# EAGLE design LocoShield-TMH-ThroughHole (EAGLE 7.7.0)
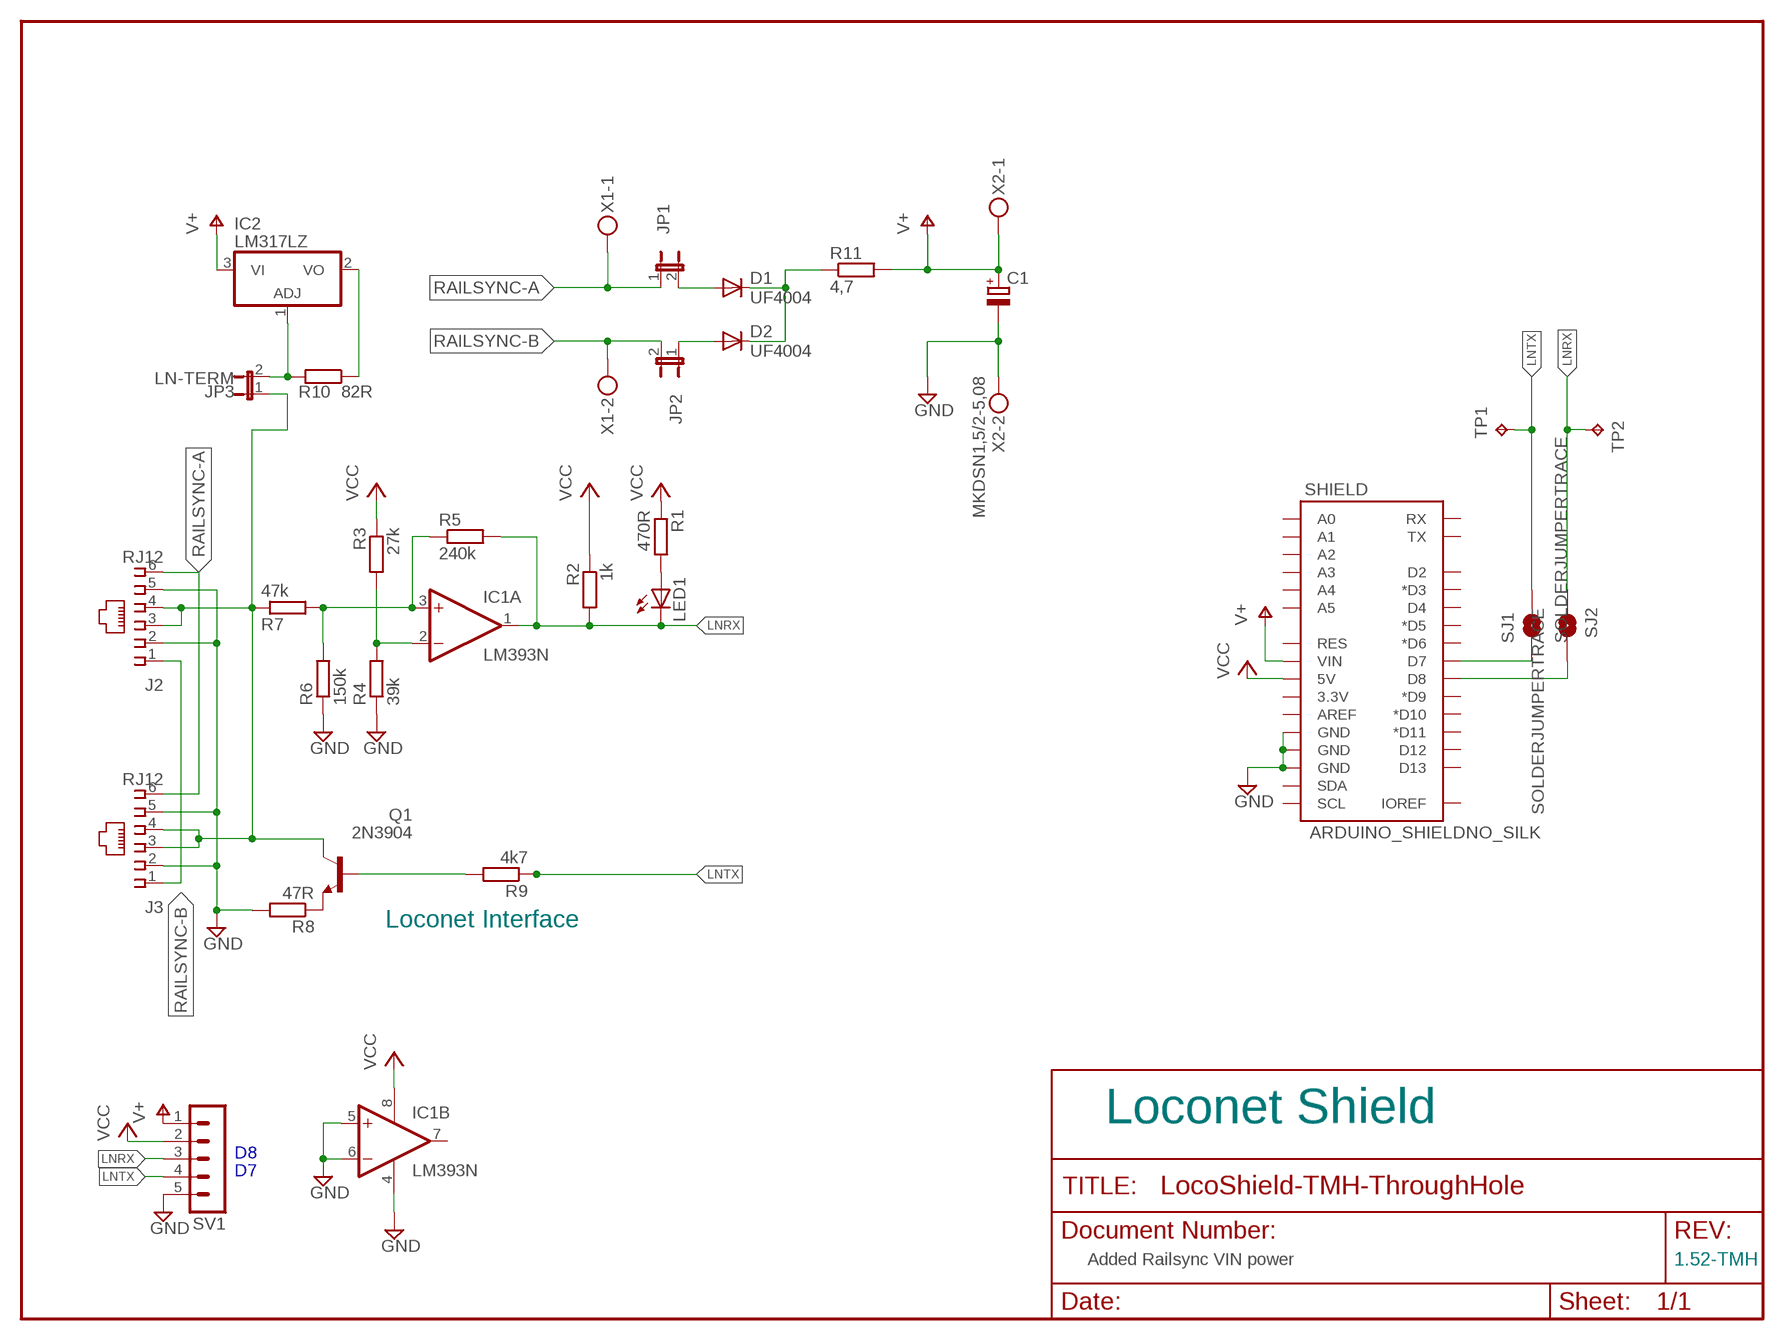
[diagram p0: schematic, sheet 1]

## Parts
C1  CPOL-EUE2-5  [E2-5]
D1  UF4004  1N4148DO35-7  [DO35-7]
D2  UF4004  1N4148DO35-7  [DO35-7]
IC1  LM393N  [DIL08]
IC2  LM317LZ  [TO92]
J2  RJ12  520250-3  [520250-3]
J3  RJ12  520250-3  [520250-3]
JP1  JUMPER-2PTH_LOCK  [1X02_LOCK]
JP2  JUMPER-2PTH_LOCK  [1X02_LOCK]
JP3  LN-TERM  JUMPER-2PTH_LOCK  [1X02_LOCK]
LED1  LED3MM  [LED3MM]
Q1  2N3904  [TO92]
R1  470R  R-EU_0207/10  [0207/10]
R2  1k  R-EU_0207/10  [0207/10]
R3  27k  R-EU_0207/10  [0207/10]
R4  39k  R-EU_0207/10  [0207/10]
R5  240k  R-EU_0207/10  [0207/10]
R6  150k  R-EU_0207/10  [0207/10]
R7  47k  R-EU_0207/10  [0207/10]
R8  47R  R-EU_0207/10  [0207/10]
R9  4k7  R-EU_0207/10  [0207/10]
R10  82R  R-EU_0207/10  [0207/10]
R11  4,7  R-EU_0207/10  [0207/10]
SHIELD  ARDUINO_SHIELDNO_SILK  [DUEMILANOVE_VIAS]
SJ1  SOLDERJUMPERTRACE  [SJ_2S-TRACE]
SJ2  SOLDERJUMPERTRACE  [SJ_2S-TRACE]
SV1  MA05-1  [MA05-1]
TP1  TPPAD1-17  [P1-17]
TP2  TPPAD1-17  [P1-17]
X1  MKDSN1,5/2-5,08  [MKDSN1,5/2-5,08]
X2  MKDSN1,5/2-5,08  [MKDSN1,5/2-5,08]

## Nets
GND [Power]: C1.- IC1.4(P:V-) IC1.5(B:+IN) IC1.6(B:-IN) J2.2 J2.5 J3.2 J3.5 R4.1 R6.1 R8.2 SHIELD.GND@0(GND) SHIELD.GND@1(GND) SHIELD.GND@2(GND) SV1.5 X2.2
LNRX: IC1.1(A:OUT) LED1.K(C) R2.2 R5.2 SJ2.1 SV1.3 TP2.TP
LNTX: R9.1 SJ1.2 SV1.4 TP1.TP
LOCONET [Power]: J2.3 J2.4 J3.3 J3.4 JP3.1 Q1.1(C) R7.1
N$1: Q1.2(B) R9.2
N$2: IC1.3(A:+IN) R5.1 R6.2 R7.2
N$3: D1.A JP1.2
N$4: D2.A JP2.1
N$5: IC1.2(A:-IN) R3.2 R4.2
N$6: Q1.3(E) R8.1
N$7: SHIELD.D8 SJ2.2
N$8: SHIELD.D7 SJ1.1
N$9 [Power]: D1.C D2.C R11.1
N$15: LED1.A R1.2
N$20 [Power]: IC2.1(ADJ) JP3.2 R10.2
RAILSYNC-A: J2.6 J3.6 JP1.1 X1.1
RAILSYNC-B: J2.1 J3.1 JP2.2 X1.2
V+ [Power]: C1.+ IC2.3(VI) R11.2 SHIELD.VIN SV1.1 X2.1
VCC [Power]: IC1.8(P:V+) R1.1 R2.1 R3.1 SHIELD.5V SV1.2
VOUT [Power]: IC2.2(VO) R10.1
Unconnected: IC1.7(B:OUT) SHIELD.3.3V SHIELD.A0 SHIELD.A1 SHIELD.A2 SHIELD.A3 SHIELD.A4 SHIELD.A5 SHIELD.AREF SHIELD.D2 SHIELD.D3(*D3) SHIELD.D4 SHIELD.D5(*D5) SHIELD.D6(*D6) SHIELD.D9(*D9) SHIELD.D10(*D10) SHIELD.D11(*D11) SHIELD.D12 SHIELD.D13 SHIELD.IOREF SHIELD.RES SHIELD.RX SHIELD.SCL SHIELD.SDA SHIELD.TX

## Notes on the sheet
- Loconet Interface
- Loconet Shield
- D8
- D7
- Added Railsync VIN power | 1.52-TMH

## Library data of the parts
C1 = rcl:CPOL-EU: POLARIZED CAPACITOR, European symbol
D1 D2 = diode:1N4148: DIODE high speed (Philips); ELFA: 170-02-221
IC1 = linear:LM393: COMPARATOR; ELFA: 300-19-446
IC2 = linear:*317: Positive VOLTAGE REGULATOR; ELFA: 173-12-085
J2 J3 = con-amp:520250-3: AMP connector; ELFA: 42-688-27
JP1 JP2 = SPCoast:JUMPER-2: Jumper Basic 0.1" spaced jumper. Use with breakaway headers.; ELFA: 124-50-887
JP3 = MCP:JUMPER-2: Jumper Basic 0.1" spaced jumper. Use with breakaway headers.; ELFA: 124-50-887
LED1 = adafruit:LED: LED OSRAM: - CHIPLED LG R971, LG N971, LY N971, LG Q971, LY Q971, LO R971, LY R971 LH N974, LH R974 LS Q976, LO Q976, LY Q976 LO Q996 - Hyper CHIPLED LW Q18S LB Q993, LB Q99A, LB R99A - SideLED LS A670, LO A670, LY A670, LG A670, LP A670 LB A673, LV A673, LT A673, LW A673 LH A674 LY A675 LS A676, LA A676, LO A676, LY A676, LW A676 LS A679, LY A679, LG A679 - Hyper Micro SIDELED® LS Y876, LA Y876, LO Y876, LY Y876 LT Y87S - SmartLED LW L88C, LW L88S LB L89C, LB L89S, LG L890 LS L89K, LO L89K, LY L89K LS L896, LA L896, LO L896, LY L896 - TOPLED LS T670, LO T670, LY T670, LG T670, LP T670 LSG T670, LSP T670, LSY T670, LOP T670, LYG T670 LG T671, LOG T671, LSG T671 LB T673, LV T673, LT T673, LW T673 LH T674 LS T676, LA T676, LO T676, LY T676, LB T676, LH T676, LSB T676, LW T676 LB T67C, LV T67C, LT T67C, LS T67K, LO T67K, LY T67K, LW E67C LS E67B, LA E67B, LO E67B, LY E67B, LB E67C, LV E67C, LT E67C LW T67C LS T679, LY T679, LG T679 LS T770, LO T770, LY T770, LG T770, LP T770 LB T773, LV T773, LT T773, LW T773 LH T774 LS E675, LA E675, LY E675, LS T675 LS T776, LA T776, LO T776, LY T776, LB T776 LHGB T686 LT T68C, LB T68C - Hyper Mini TOPLED® LB M676 - Mini TOPLED Santana® LG M470 LS M47K, LO M47K, LY M47K Source: http://www.osram.convergy.de/; ELFA: 175-01-530
Q1 = transistor:2N3904: NPN TRANSISTOR; ELFA: 171-30-038
R1 = rcl:R-EU_: RESISTOR, European symbol; ELFA: 160-59-206
R2 = rcl:R-EU_: RESISTOR, European symbol; ELFA: 160-59-214
R3 = rcl:R-EU_: RESISTOR, European symbol; ELFA: 160-59-253
R4 = rcl:R-EU_: RESISTOR, European symbol; ELFA: 160-59-257
R5 = rcl:R-EU_: RESISTOR, European symbol; ELFA: 160-59-277
R6 = rcl:R-EU_: RESISTOR, European symbol; ELFA: 160-59-271
R7 = rcl:R-EU_: RESISTOR, European symbol; ELFA: 160-59-259
R8 = rcl:R-EU_: RESISTOR, European symbol; ELFA: 160-59-181
R9 = rcl:R-EU_: RESISTOR, European symbol; ELFA: 160-73-043
R10 = rcl:R-EU_: RESISTOR, European symbol; ELFA: 160-59-187
R11 = rcl:R-EU_: RESISTOR, European symbol; ELFA: 160-59-157
SHIELD = SPCoast:ARDUINO_SHIELD
SJ1 SJ2 = SparkFun-Retired:SOLDERJUMPER: Solder Jumper Standard SMD solder jumper. Used to automate production. Two varients : Normally Open and Normally Closed are the same, but have different paste layers. NC will have a large amount of paste and should jumper during reflow.
SV1 = con-lstb:MA05-1: PIN HEADER; ELFA: 143-00-499; OC_FARNELL: unknown; OC_NEWARK: unknown
TP1 TP2 = testpad:TP: Test pad
X1 X2 = con-phoenix-508:MKDSN1,5/2-5,08: MKDSN 1,5/ 2-5,08 Printklemme Nennstrom: 13,5 A Nennspannung: 250 V Rastermaß: 5,08 mm Polzahl: 2 Anschlussart: Schraubanschluss Montage: Löten Anschlussrichtung Leiter/Platine: 0 ° Artikelnummer: 1729128 Source: http://eshop.phoenixcontact.com .. 1729128.pdf; ELFA: 148-45-038

## Net classes
0 default: width 0.254 mm
1 Power: width 0.406 mm, clearance 0.254 mm

## Board
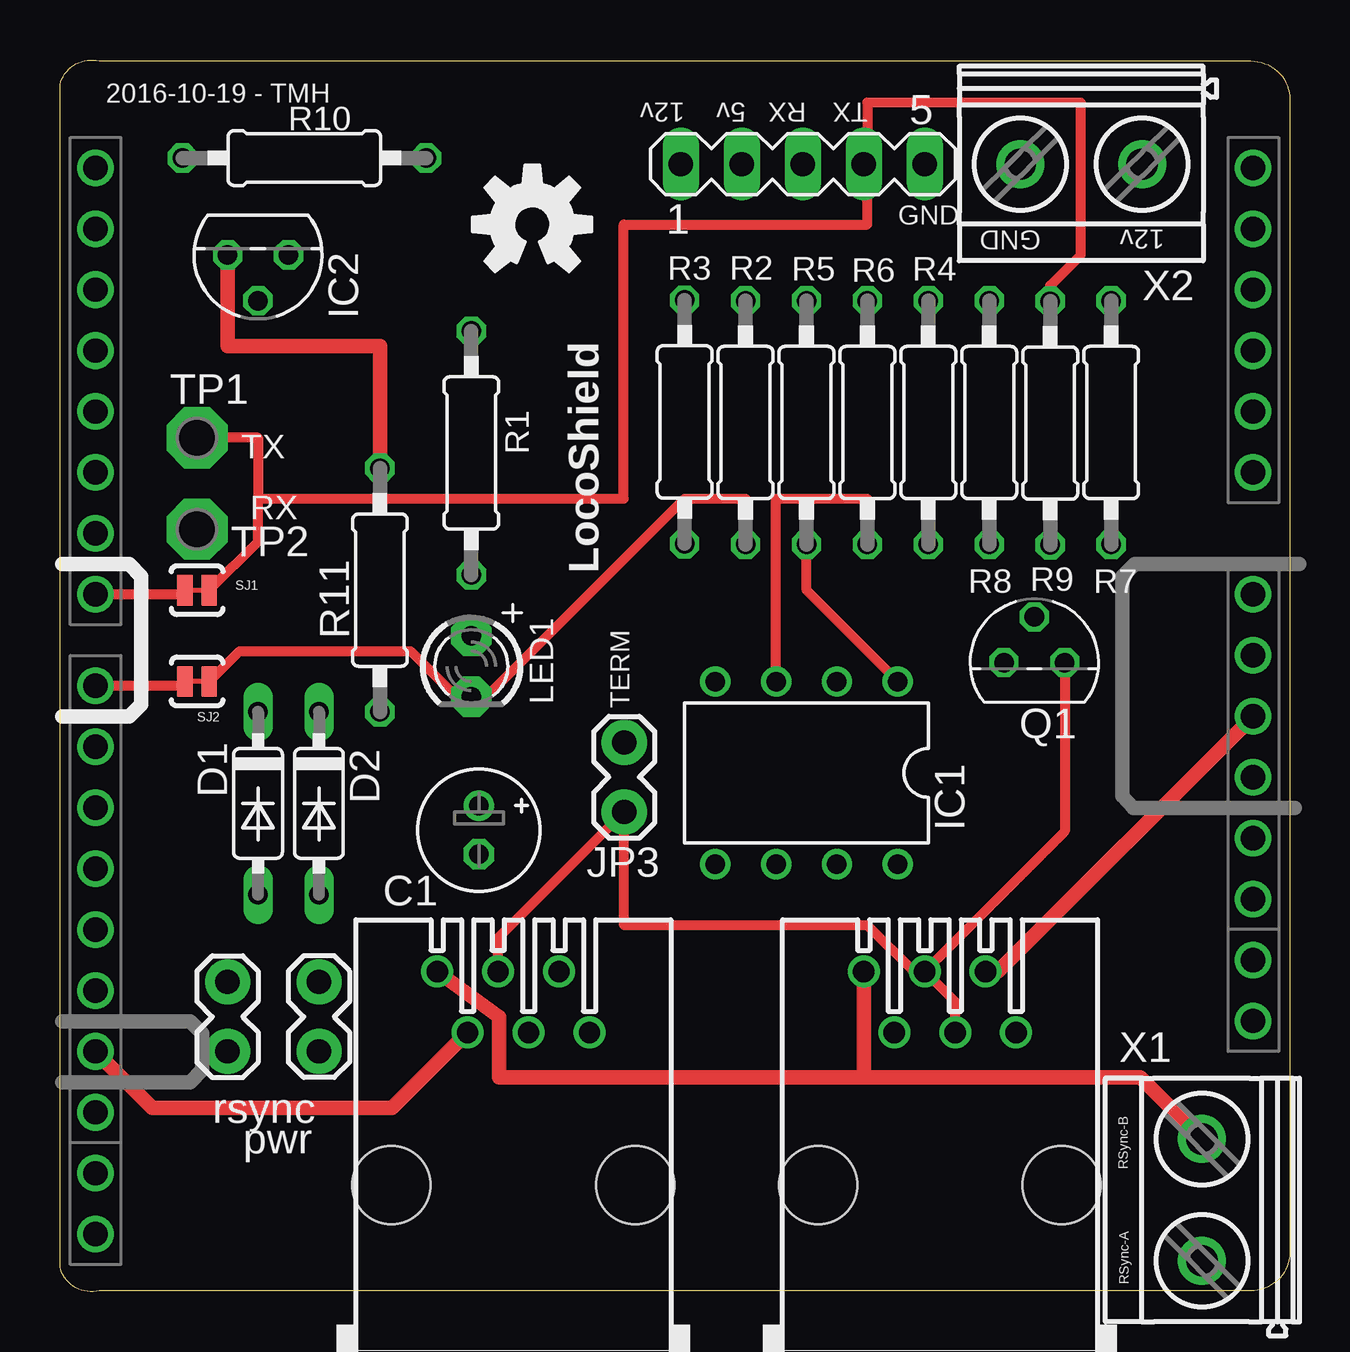
[diagram p1: board, top side]
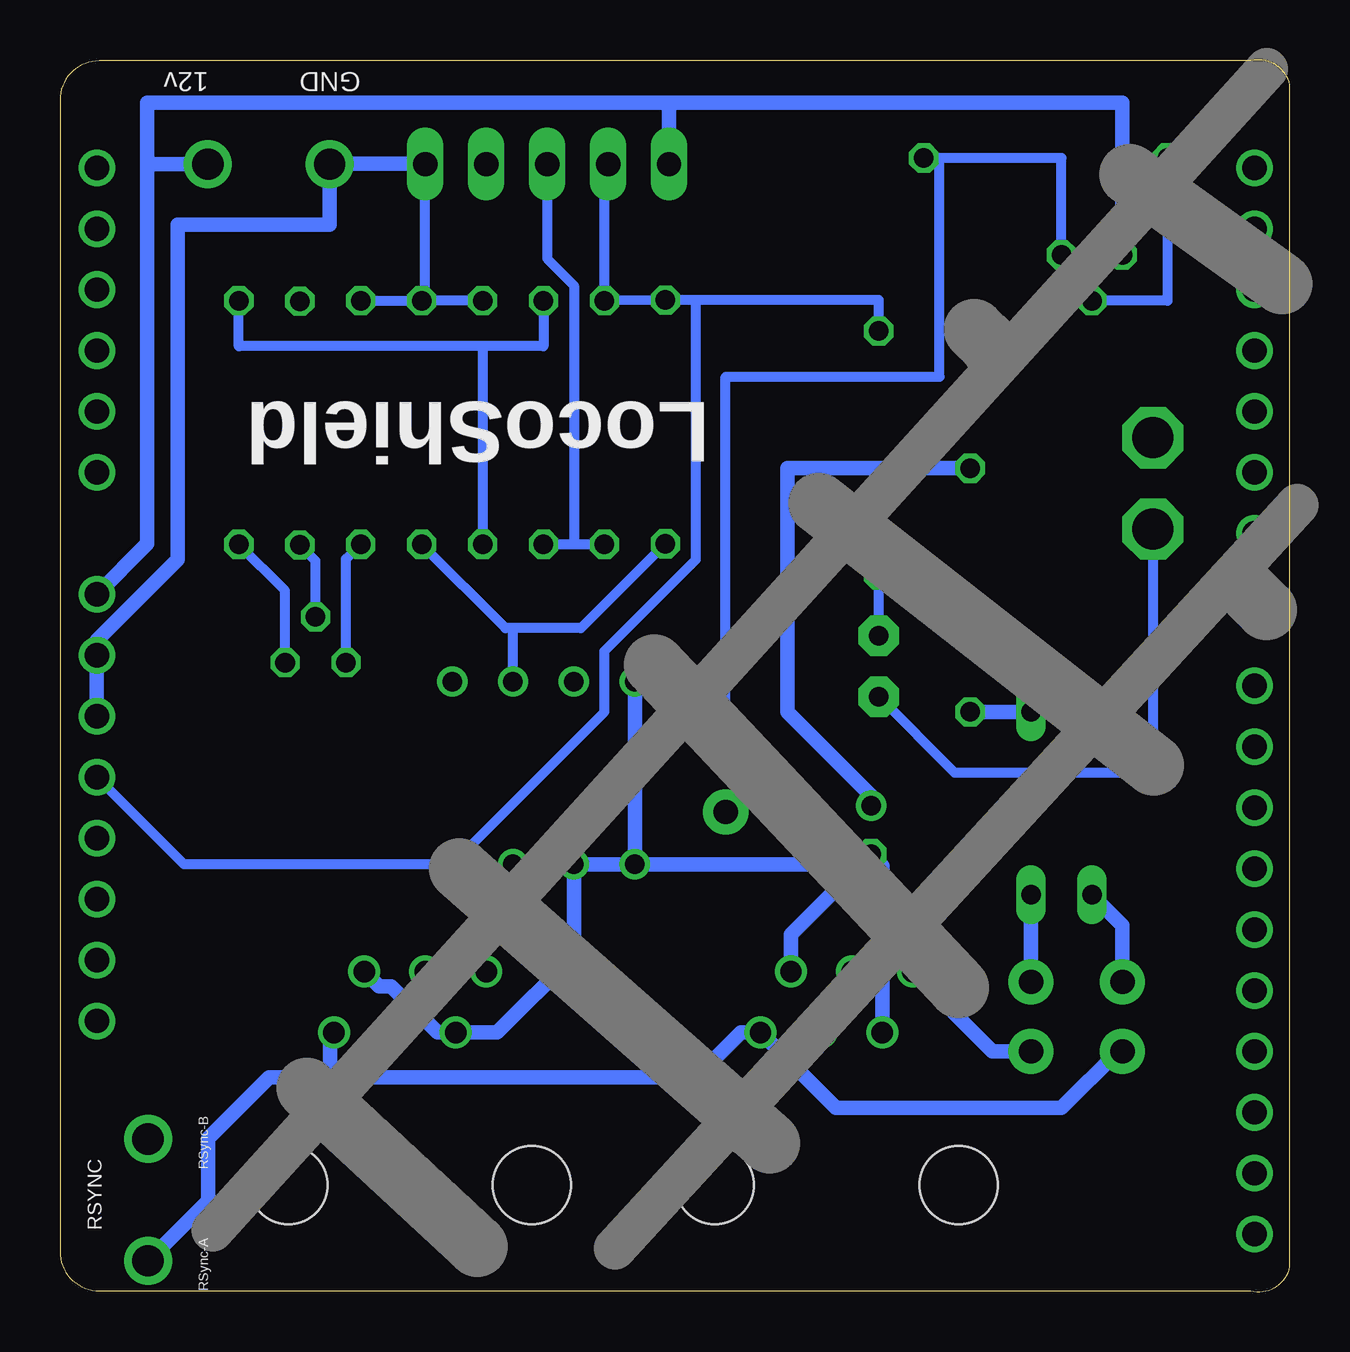
[diagram p2: board, bottom side, seen from below]

Size 51.27 x 51.34 mm. Coordinates in mm from the lower left corner, seen from the top.
Outline: 1.64,0.04 arc-90 0,1.04 0,50.31 arc-90 1.64,51.31 49.63,51.31 arc-90 51.27,49.67 51.27,1.67 arc-90 49.63,0.04 1.64,0.04
Copper layers (1*16): Top 0.0356mm / dielectric 1.5011mm / Bottom 0.0356mm
Design rules "oshpark-2layer": minimum track width 6mil, minimum drill 13mil, track to track 6mil, track to pad 6mil, pad to pad 6mil, via to via 6mil, smd to smd 6mil, copper to edge 15mil, drill to drill 6mil, minimum pad ring 7mil, minimum via ring 7mil, stop-mask expansion 4mil, vias tented up to drill 0mil, thermal gap 10mil

### Footprints (pad centres in the part's own frame; a part is rotated, then mirrored left to right if it is on the bottom)
E2-5 = drill 0.813 pad 1.27: + -1.016,0 | drill 0.813 pad 1.27 octagon: - 1.016,0
DO35-7 = drill 0.813 long: A 3.81,0; C -3.81,0
DIL08 = drill 0.813 pad 1.27: 1 -3.81,-3.81; 2 -1.27,-3.81; 3 1.27,-3.81; 4 3.81,-3.81; 5 3.81,3.81; 6 1.27,3.81; 7 -1.27,3.81; 8 -3.81,3.81
TO92 = drill 0.813 octagon: 1 -1.27,0; 2 0,1.905; 3 1.27,0
520250-3 = drill 0.889: 1 -3.175,8.89; 2 -1.905,6.35; 3 -0.635,8.89; 4 0.635,6.35; 5 1.905,8.89; 6 3.175,6.35 | hole 3.251: -5.08,0; 5.08,0
1X02_LOCK = drill 1.016 pad 1.88: 1 -0.178,0; 2 2.718,0
LED3MM = drill 0.813 pad 1.676 octagon: A -1.27,0; K 1.27,0
TO92' = drill 0.813 octagon: 1 1.27,0; 2 0,1.905; 3 -1.27,0
0207/10 = drill 0.813 octagon: 1 -5.08,0; 2 5.08,0
DUEMILANOVE_VIAS = drill 1.016: 3.3V 49.53,17.78; 5V 49.53,20.32; A0 49.53,33.02; A1 49.53,35.56; A2 49.53,38.1; A3 49.53,40.64; A4 49.53,43.18; A5 49.53,45.72; AREF 1.27,6.35; D2 1.27,40.64; D3 1.27,38.1; D4 1.27,35.56; D5 1.27,33.02; D6 1.27,30.48; D7 1.27,27.94; D8 1.27,24.13; D9 1.27,21.59; D10 1.27,19.05; D11 1.27,16.51; D12 1.27,13.97; D13 1.27,11.43; GND@0 49.53,22.86; GND@1 49.53,25.4; GND@2 1.27,8.89; IOREF 49.53,12.7; NC1 49.53,10.16; RES 49.53,15.24; RX 1.27,45.72; SCL 1.27,1.27; SDA 1.27,3.81; TX 1.27,43.18; VIN 49.53,27.94
SJ_2S-TRACE = smd 0.635 x 1.27: 1 -0.508,0; 2 0.508,0
MA05-1 = drill 1.016 long: 1 -5.08,0; 2 -2.54,0; 3 0,0; 4 2.54,0; 5 5.08,0
P1-17 = drill 1.702 pad 2.54 octagon: TP 0,0
MKDSN1,5/2-5,08 = drill 1.3 pad 2: 1 -2.561,0.025; 2 2.519,0.025

### Placement (x,y rotation side)
C1  17.46,19.25 270 top
D1  8.26,20.36 270 top
D2  10.79,20.36 270 top
IC1  31.12,21.63 180 top
IC2  8.26,43.22 180 top
J2  36.68,4.46 0 top
J3  18.9,4.46 0 top
JP1  6.98,10.2 90 top
JP2  10.79,12.74 270 top
JP3  23.52,20.18 90 top
LED1  17.15,26.07 270 top
Q1  2N3904  [TO92']  40.61,26.22 0 top
R1  17.15,34.96 270 top
R2  28.58,36.23 270 top
R3  26.04,36.26 270 top
R4  36.2,36.23 270 top
R5  31.12,36.23 270 top
R6  33.66,36.23 270 top
R7  43.81,36.23 90 top
R8  38.73,36.23 90 top
R9  41.27,36.21 270 top
R10  10.19,47.26 0 top
R11  13.33,29.25 90 top
SHIELD  0.2,1.13 0 top
SJ1  5.71,29.25 0 top
SJ2  5.71,25.44 180 top
SV1  30.96,47 0 top
TP1  5.71,35.6 0 top
TP2  5.71,31.79 0 top
U$1  OSHW-LOGOM  [OSHW-LOGO-M]  19.69,44.49 0 top
X1  47.62,3.85 90 top
X2  42.54,47.03 180 top

### Tracks (layer width: path | path; a pad name or v marks a point on that pad's centre or on a via)
GND
  Top 0.61: J3.2 13.84,7.66 3.83,7.66 SHIELD.GND@2 | SHIELD.GND@0 39.09,13.35 J2.5
  Bottom 0.406: SHIELD.GND@1 SHIELD.GND@0 | R4.1 36.04,41.31 SV1.5 36.07,47.03 | R6.1 R4.1 | R8.2 R4.1 | 16.99,17.76 17.1,17.86 | 17.1,17.86 C1.- | 17.15,17.82 17.1,17.86
  Bottom 0.61: SHIELD.GND@0 49.73,27.14 46.35,30.52 46.35,44.49 40.03,44.49 X2.2 40.03,47.03 36.07,47.03 | J3.5 20.8,14.89 C1.- | J3.2 16.99,17.76 | IC1.5 17.15,17.82 | IC1.5 IC1.6 29.85,14.01 33.04,10.81 J2.2 35.53,10.81 37.46,12.74 37.97,12.74 J2.5 | IC1.5 IC1.4
LNRX
  Top 0.406: IC1.1 31.12,29.25 R5.2 | SJ2.1 7.49,26.71 14.61,26.71 16.51,24.8 LED1.K 17.78,24.8 26.04,33.06 28.58,33.06 R2.2
  Bottom 0.406: R2.2 29.85,31.15 | 29.85,31.15 R5.2 | SV1.3 30.96,43.06 29.85,41.95 29.85,31.15 | TP2.TP 5.71,21.63 13.97,21.63 LED1.K
LNTX
  Top 0.406: R9.1 41.27,41.95 42.54,43.22 42.54,49.57 33.66,49.57 33.66,47 | SJ1.2 8.26,31.28 8.26,33.06 | TP1.TP 8.26,35.6 8.26,33.06 | 8.26,33.06 23.5,33.06 23.5,44.49 33.66,44.49 33.66,47 | 33.66,47 SV1.4
LOCONET
  Top 0.406: J3.3 18.26,14.74 JP3.1 23.52,15.28 33.66,15.28 35.59,13.35 J2.3 | J2.4 37.31,12.08 J2.3 | Q1.1 41.88,19.19 J2.3
  Bottom 0.406: Q1.1 41.88,29.22 R7.1 | J3.4 J3.3
N$1
  Bottom 0.406: Q1.2 40.61,30.47 R9.2
N$2
  Top 0.406: IC1.3 29.85,33.06 33.66,33.06 R6.2
  Bottom 0.406: 33.66,39.41 43.81,39.41 R7.2 | R5.1 31.12,39.41 33.66,39.41 | 33.66,39.41 R6.2
N$3
  Bottom 0.61: JP1.2 6.98,15.28 D1.A
N$4
  Bottom 0.61: JP2.1 D2.A
N$5
  Bottom 0.406: R4.2 32.7,27.66 32.38,27.66 | R3.2 29.55,27.66 32.38,27.66 | IC1.2 32.38,27.66
N$6
  Bottom 0.406: Q1.3 39.34,30.54 R8.1
N$7
  Top 0.406: SJ2.2 5.03,25.26 SHIELD.D8
N$8
  Top 0.406: SJ1.1 5.03,29.07 SHIELD.D7
N$9
  Bottom 0.61: D1.C D2.C R11.1
N$15
  Bottom 0.406: LED1.A R1.2
N$20
  Bottom 0.406: IC2.1 9.53,47.26 R10.2 14.61,47.26 14.61,38.14 23.52,38.14 JP3.2
RAILSYNC-A
  Bottom 0.61: 40,8.93 42.54,8.93 45.09,6.39 45.09,3.8 X1.1 | J2.6 40,10.65 40,8.93 | 40,8.93 24.77,8.93 22.89,10.81 J3.6 18.92,7.66 9.53,7.66 7.16,10.02 JP1.1
RAILSYNC-B
  Top 0.61: J3.1 18.31,11.45 18.31,8.93 33.5,8.93 | X1.2 45.04,8.93 33.66,8.93 33.5,8.93 | J2.1 33.5,8.93
  Bottom 0.61: JP2.2 12.39,10.02 J3.1
V+
  Top 0.61: IC2.3 6.98,39.41 13.33,39.41 R11.2
  Bottom 0.61: SHIELD.VIN 47.62,31.18 47.62,47 | 47.62,47 47.62,49.57 25.88,49.57 | SV1.1 25.88,49.57 | 25.88,49.57 6.98,49.57 IC2.3 | R11.2 20.96,34.33 20.96,24.17 17.46,20.68 C1.+ | X2.1 47.62,47
VCC
  Bottom 0.406: SV1.2 28.58,46.85 R2.1 R3.1 24.77,41.34 | SHIELD.5V 46.1,17.82 IC1.8 28.58,24.17 28.58,26.71 24.77,30.52 24.77,41.34 | R1.1 17.15,41.34 24.77,41.34
VOUT
  Bottom 0.406: R10.1 5.1,41.31 IC2.2

### Text on the board
tPlace: 2016-10-19 - TMH | 12v | 5v | RX | TX | GND | 12v | GND | TX | RX | LocoShield | TERM | rsync | pwr | RSync-B | RSync-A
bPlace: GND | 12v | LocoShield | RSync-B | RSYNC | RSync-A
tDocu: * | Component / Side | To Lnet
bDocu: Made in the PCR, Coast Division, NMRA | LocoShield | Solder Side | Go Bears! | SP Coast | www. | .com | RX pin goes to Timer ICP pin / Uno -> pin 8 / Leonardo -> pin 4 / Mega -> pin 48 (Timer 5) or 49 (T4) | Model Railroading is fun!